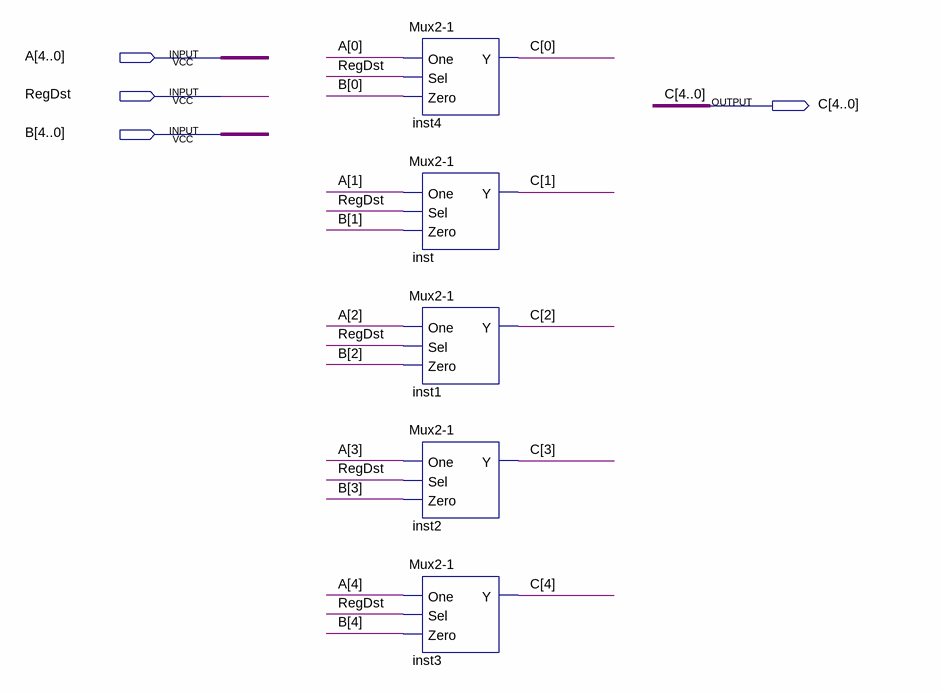
[diagram p0: schematic sheet]
// Quartus schematic Mux2-1-5bits.bdf as structural Verilog: 5 symbols, 4 pins
module \Mux2-1-5bits  (
  input  [4:0] A,
  input  RegDst,
  input  [4:0] B,
  output [4:0] C
);

  \Mux2-1  inst4 (.One(A[0]), .Sel(RegDst), .Zero(B[0]), .Y(C[0]));
  \Mux2-1  inst (.One(A[1]), .Sel(RegDst), .Zero(B[1]), .Y(C[1]));
  \Mux2-1  inst1 (.One(A[2]), .Sel(RegDst), .Zero(B[2]), .Y(C[2]));
  \Mux2-1  inst2 (.One(A[3]), .Sel(RegDst), .Zero(B[3]), .Y(C[3]));
  \Mux2-1  inst3 (.One(A[4]), .Sel(RegDst), .Zero(B[4]), .Y(C[4]));
endmodule
